# EAGLE design Adafruit FONA SIM5320 3G Breakout (EAGLE 8.2.2)
COMPANY: ADAFRUIT INDUSTRIES; DRAWN: KTOWN; REV: A
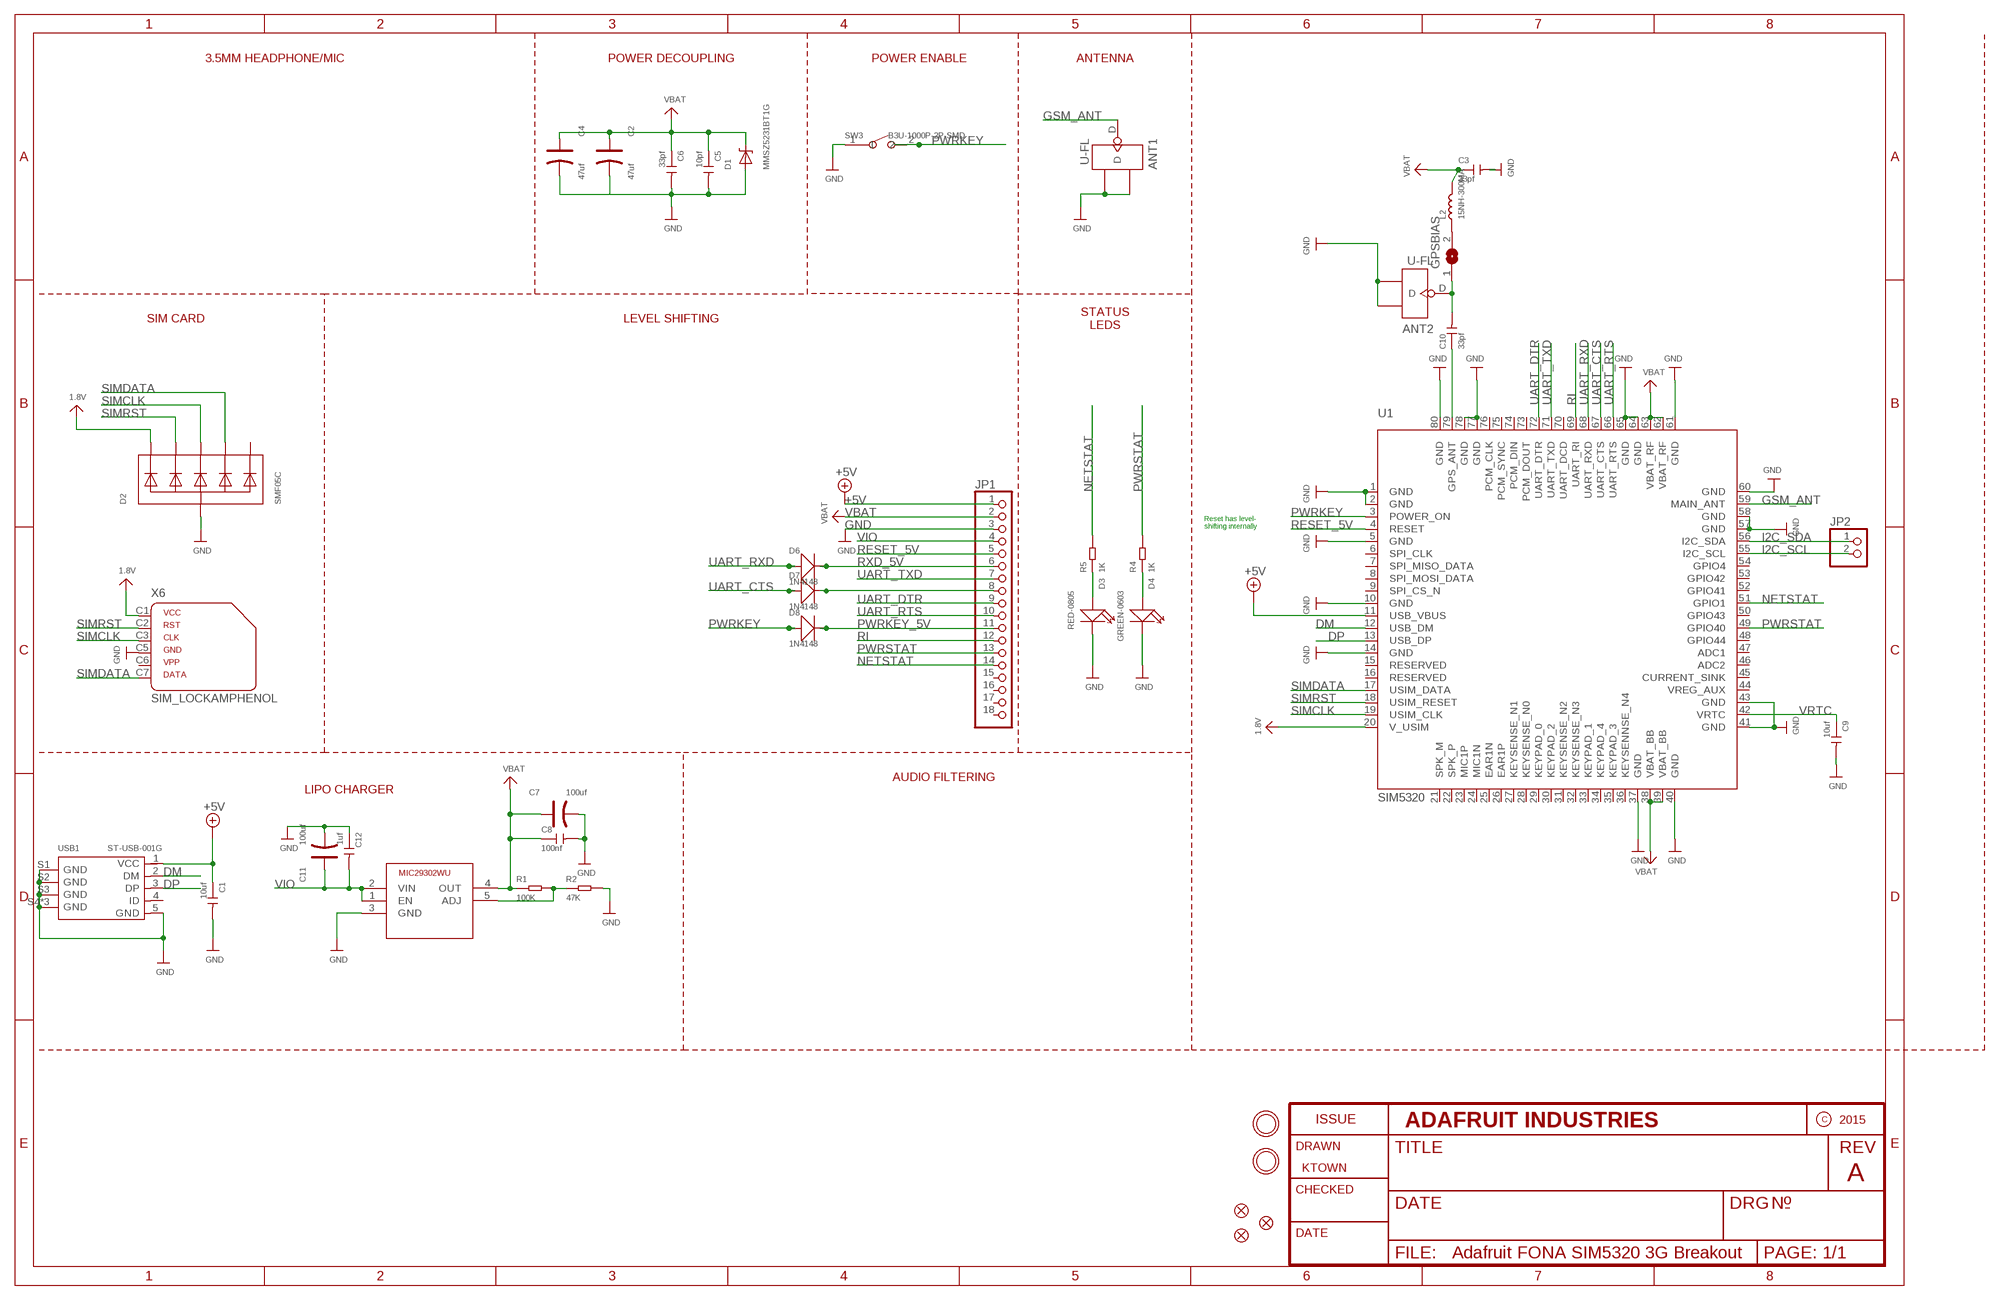
[diagram p0: schematic, sheet 1]

## Parts
ANT1  U-FL  ANTENNA-CONN-U-FL(3P)  [U-FL3P-SMD-2.6X2.6X1.0MM]
ANT2  U-FL  ANTENNA-CONN-U-FL(3P)  [U-FL3P-SMD-2.6X2.6X1.0MM]
C1  10uf  CERAMIC-10UF-10V-10%-X5R(0603)  [C0603]
C2  47uf  TANTALUM-SMD-47UF-16V-10%(AVX-B)  [AVX-B]
C3  33pf  CERAMIC-33PF-50V-5%-NPO(0402)  [C0402]
C4  47uf  TANTALUM-SMD-47UF-16V-10%(AVX-B)  [AVX-B]
C5  10pf  CERAMIC-10PF-50V-5%-NPO(0402)  [C0402]
C6  33pf  CERAMIC-33PF-50V-5%-NPO(0402)  [C0402]
C7  100uf  TANTALUM-SMD-100UF-10V(AVX-B)  [AVX-B]
C8  100nf  CERAMIC-100NF-25V-10%-X7R(0402)  [C0402]
C9  10uf  CERAMIC-10UF-25V-10%-X5R(0805)  [C0805]
C10  33pf  CERAMIC-33PF-50V-5%-NPO(0402)  [C0402]
C11  100uf  TANTALUM-SMD-100UF-10V(AVX-B)  [AVX-B]
C12  1uf  CERAMIC-1UF-25V-10%-X7R(0603)  [C0603]
D1  MMSZ5231BT1G  DIODE-ZENERSOD123  [SOD-123]
D2  SMF05C  TVSARRAY_5LANE  [SOT363]
D3  RED-0805  SMD-LED-CLEAR-RED(0805)  [LED-0805]
D4  GREEN-0603  SMD-LED-CLEAR-GREEN(0603)  [LED-0603]
D6  1N4148  SMD-DIODE-SWITCH-1N4148(LL-34)  [LL-34]
D7  1N4148  SMD-DIODE-SWITCH-1N4148(LL-34)  [LL-34]
D8  1N4148  SMD-DIODE-SWITCH-1N4148(LL-34)  [LL-34]
FID1  FIDUCIAL""  [FIDUCIAL_1MM]
FID4  FIDUCIAL""  [FIDUCIAL_1MM]
FID5  FIDUCIAL""  [FIDUCIAL_1MM]
GPSBIAS  SOLDERJUMPER  [SOLDERJUMPER_ARROW_NOPASTE]
IC1  MIC29302WU  [TO263-5]
JP1  HEADER-1X18  [1X18_ROUND70]
JP2  HEADER-1X2ROUND  [1X02_ROUND]
L2  15NH-300MA  SMD-INDUCTOR-15NH-5%-300MA(0402)  [L0402]
R1  100K  SMD-RES-100K-1%-1/10W(0603)  [R0603]
R2  47K  SMD-RES-47K-5%-1/10W(0603)  [R0603]
R4  1K  SMD-RES-1K-1%-1/10W(0603)  [R0603]
R5  1K  SMD-RES-1K-1%-1/10W(0603)  [R0603]
SW3  B3U-1000P-2P-SMD  SMD-BUTTON(2P-3.0X2.5X1.2+0.4MM)-B3U-1000P-2P-SMD  [SW2-2.6-3.0X2.5X1.2+0.4MM]
U1  SIM5320  GSM_SIM5320_LITERAL  [SIM5320]
U$33  MOUNTINGHOLE2.5  [MOUNTINGHOLE_2.5_PLATED]
U$34  MOUNTINGHOLE2.5  [MOUNTINGHOLE_2.5_PLATED]
USB1  ST-USB-001G  MICRO-USB-SMD-B-WITHOUT-POST-W/P(ST-USB-001G)  [MICRO-USB5+4P-SMD-0.65-B]
X6  SIM_LOCKAMPHENOL  [C707_10M006_512_2]

## Nets
1.8V: D2.1(C1) U1.20(V_USIM) X6.C1
+5V: C1.1 JP1.1 U1.11(USB_VBUS) USB1.1(VCC)
CTS_5V: D7.C(-) JP1.8
DM: U1.12(USB_DM) USB1.2(DM)
DP: U1.13(USB_DP) USB1.3(DP)
GND: ANT1.GND1 ANT1.GND2 ANT2.GND1 ANT2.GND2 C1.2 C2.- C3.2 C4.- C5.2 C6.2 C7.- C8.2 C9.2 C11.- C12.1 D1.A D2.2(A) D3.- D4.- IC1.3(GND) JP1.3 R2.2 SW3.1 U1.1(GND) U1.2(GND) U1.5(GND) U1.10(GND) U1.14(GND) U1.37(GND) U1.40(GND) U1.41(GND) U1.43(GND) U1.57(GND) U1.58(GND) U1.60(GND) U1.61(GND) U1.64(GND) U1.65(GND) U1.77(GND) U1.78(GND) U1.80(GND) USB1.5(GND) USB1.S1(GND) USB1.S2(GND) USB1.S3(GND) USB1.S4(GND) USB1.S5(GND) USB1.S6(GND) X6.C5
GSM_ANT: ANT1.D U1.59(MAIN_ANT)
I2C_SCL: JP2.2 U1.55(I2C_SCL)
I2C_SDA: JP2.1 U1.56(I2C_SDA)
N$2: IC1.5(ADJ) R1.2 R2.1
N$3: ANT2.D C10.2 GPSBIAS.1
N$4: D4.+ R4.1
N$7: C10.1 U1.79(GPS_ANT)
N$9: D3.+ R5.1
N$31: GPSBIAS.2 L2.1
NETSTAT: JP1.14 R5.2 U1.51(GPIO1)
PWRKEY: D8.A(+) SW3.2 U1.3(POWER_ON)
PWRKEY_5V: D8.C(-) JP1.11
PWRSTAT: JP1.13 R4.2 U1.49(GPIO40)
RESET_5V: JP1.5 U1.4(RESET)
RI: JP1.12 U1.69(UART_RI)
RXD_5V: D6.C(-) JP1.6
SIMCLK: D2.4(C3) U1.19(USIM_CLK) X6.C3
SIMDATA: D2.5(C4) U1.17(USIM_DATA) X6.C7
SIMRST: D2.3(C2) U1.18(USIM_RESET) X6.C2
UART_CTS: D7.A(+) U1.67(UART_CTS)
UART_DTR: JP1.9 U1.72(UART_DTR)
UART_RTS: JP1.10 U1.66(UART_RTS)
UART_RXD: D6.A(+) U1.68(UART_RXD)
UART_TXD: JP1.7 U1.71(UART_TXD)
VBAT: C2.+ C3.1 C4.+ C5.1 C6.1 C7.+ C8.1 D1.C IC1.4(OUT) JP1.2 L2.2 R1.1 U1.38(VBAT_BB) U1.39(VBAT_BB) U1.62(VBAT_RF) U1.63(VBAT_RF)
VIO: C11.+ C12.2 IC1.1(EN) IC1.2(VIN) JP1.4
VRTC: C9.1 U1.42(VRTC)
Unconnected: D2.6(C5) JP1.15 JP1.16 JP1.17 JP1.18 U1.6(SPI_CLK) U1.7(SPI_MISO_DATA) U1.8(SPI_MOSI_DATA) U1.9(SPI_CS_N) U1.15(RESERVED) U1.16(RESERVED) U1.21(SPK_M) U1.22(SPK_P) U1.23(MIC1P) U1.24(MIC1N) U1.25(EAR1N) U1.26(EAR1P) U1.27(KEYSENSE_N1) U1.28(KEYSENSE_N0) U1.29(KEYPAD_0) U1.30(KEYPAD_2) U1.31(KEYSENSE_N2) U1.32(KEYSENSE_N3) U1.33(KEYPAD_1) U1.34(KEYPAD_4) U1.35(KEYPAD_3) U1.36(KEYSENNSE_N4) U1.44(VREG_AUX) U1.45(CURRENT_SINK) U1.46(ADC2) U1.47(ADC1) U1.48(GPIO44) U1.50(GPIO43) U1.52(GPIO41) U1.53(GPIO42) U1.54(GPIO4) U1.70(UART_DCD) U1.73(PCM_DOUT) U1.74(PCM_DIN) U1.75(PCM_SYNC) U1.76(PCM_CLK) USB1.4(ID) X6.C6

## Notes on the sheet
- 3.5MM HEADPHONE/MIC | POWER DECOUPLING | POWER ENABLE | ANTENNA
- SIM CARD | LEVEL SHIFTING
- STATUS
  LEDS
- Reset has level-
  shifting internally
- AUDIO FILTERING
- LIPO CHARGER

## Library data of the parts
ANT1 ANT2 = Seeed-Connector:ANTENNA-CONN-U-FL(3P): 320110048
C1 = Seeed-Capacitor:CERAMIC-10UF-10V-10%-X5R(0603): 302010103; MPN: CC0603KRX5R6BB106
C2 C4 = Seeed-Capacitor:TANTALUM-SMD-47UF-16V-10%(AVX-B): 302020020; MPN: TAJB476K010RNJ
C3 C6 C10 = Seeed-Capacitor:CERAMIC-33PF-50V-5%-NPO(0402): 302010000; MPN: CC0402JRNPO9BN330
C5 = Seeed-Capacitor:CERAMIC-10PF-50V-5%-NPO(0402): 302010001; MPN: CC0402JRNPO9BN100
C7 C11 = Seeed-Capacitor:TANTALUM-SMD-100UF-10V(AVX-B): 302020015; MPN: TAJB107M010#NJ
C8 = Seeed-Capacitor:CERAMIC-100NF-25V-10%-X7R(0402): 302010024; MPN: CC0402KRX7R8BB104
C9 = Seeed-Capacitor:CERAMIC-10UF-25V-10%-X5R(0805): 302010178; MPN: CC0805KKX5R8BB106
C12 = Seeed-Capacitor:CERAMIC-1UF-25V-10%-X7R(0603): 302010139; MPN: CC0603KRX7R8BB105
D1 = microbuilder:DIODE-ZENER: Zener Diode SMA: 30V 1W Zener Diode, 1.2Vf - Digikey: SMAZ30-FDICT-ND
D2 = microbuilder:TVSARRAY_5LANE: Voltage Transient Suppressor Array SOT363 SMF05C - 100W 5V: Digikey - SMF05CT1GOSCT-ND
D3 = Seeed-LED:SMD-LED-CLEAR-RED(0805): 304090046; MPN: 17-215SURC/S530-A2/TR8
D4 = Seeed-LED:SMD-LED-CLEAR-GREEN(0603): 304090043; MPN: 19-217-G7C-AN1P2-3T
D6-D8 = Seeed-Diode:SMD-DIODE-SWITCH-1N4148(LL-34): 304040016; MPN: 1N4148
FID1 FID4 FID5 = microbuilder:FIDUCIAL: Fiducial Alignment Points Various fiducial points for machine vision alignment.; BOM: EXCLUDE
GPSBIAS = microbuilder:SOLDERJUMPER: SMD Solder JUMPER Solder the two pads together to create a connection, or remove the solder to break it. REFLOW - Use this footprint for solder paste and reflow ovens. WAVE - Use this footprint for hand-soldering (larger pads). CLOSED - Has a trace between the two pads to ensure it is closed by default. The trace needs to be cut to disable the jumper, and can be closed again by creating a solder bridge between the two pads.; BOM: EXCLUDE
IC1 = MIC29302WU:MIC29302WU; AVAILABILITY: Good; DESCRIPTION: MIC29302 Series 3 A 1.24 to 26 V ADJ Output Voltage LDO Regulator - TO-263-5; MF: Microchip; MP: MIC29302WU; PACKAGE: TO-263-5 Microchip; PRICE: 1.56 USD
JP1 = microbuilder:HEADER-1X18: Header 1x18
JP2 = microbuilder:HEADER-1X2: PIN HEADER
L2 = Seeed-Inductor:SMD-INDUCTOR-15NH-5%-300MA(0402): 303010027; MPN: LQG15HS15NJ02
R1 = Seeed-Resistor:SMD-RES-100K-1%-1/10W(0603): 301010196; MPN: RC0603FR-07100KL
R2 = Seeed-Resistor:SMD-RES-47K-5%-1/10W(0603): 301010084; MPN: RC0603JR-0747KL
R4 R5 = Seeed-Resistor:SMD-RES-1K-1%-1/10W(0603): 301010298; MPN: RC0603FR-071KL
SW3 = Seeed-Switch:SMD-BUTTON(2P-3.0X2.5X1.2+0.4MM): 311020047; MPN: B3U-1000P-2P-SMD
U1 = microbuilder:GSM_SIM5320_LITERAL
U$33 U$34 = microbuilder:MOUNTINGHOLE: Mounting Hole For #2 screws (0.086"/2.18mm width, 0.094"/2.4mm hole) use 2.5mm; BOM: EXCLUDE
USB1 = Seeed-Connector:MICRO-USB-SMD-B-WITHOUT-POST-W/P(ST-USB-001G): 320010000; MPN: ST-USB-001G
X6 = microbuilder:SIM_LOCK: C707A SIMLOCK® 2.5 mm with wide solder tails Source: Data sheet <http://www.amphenol.info/downloads/C707_10M006_512_2.pdf>; OC_FARNELL: unknown; OC_NEWARK: unknown

## Board
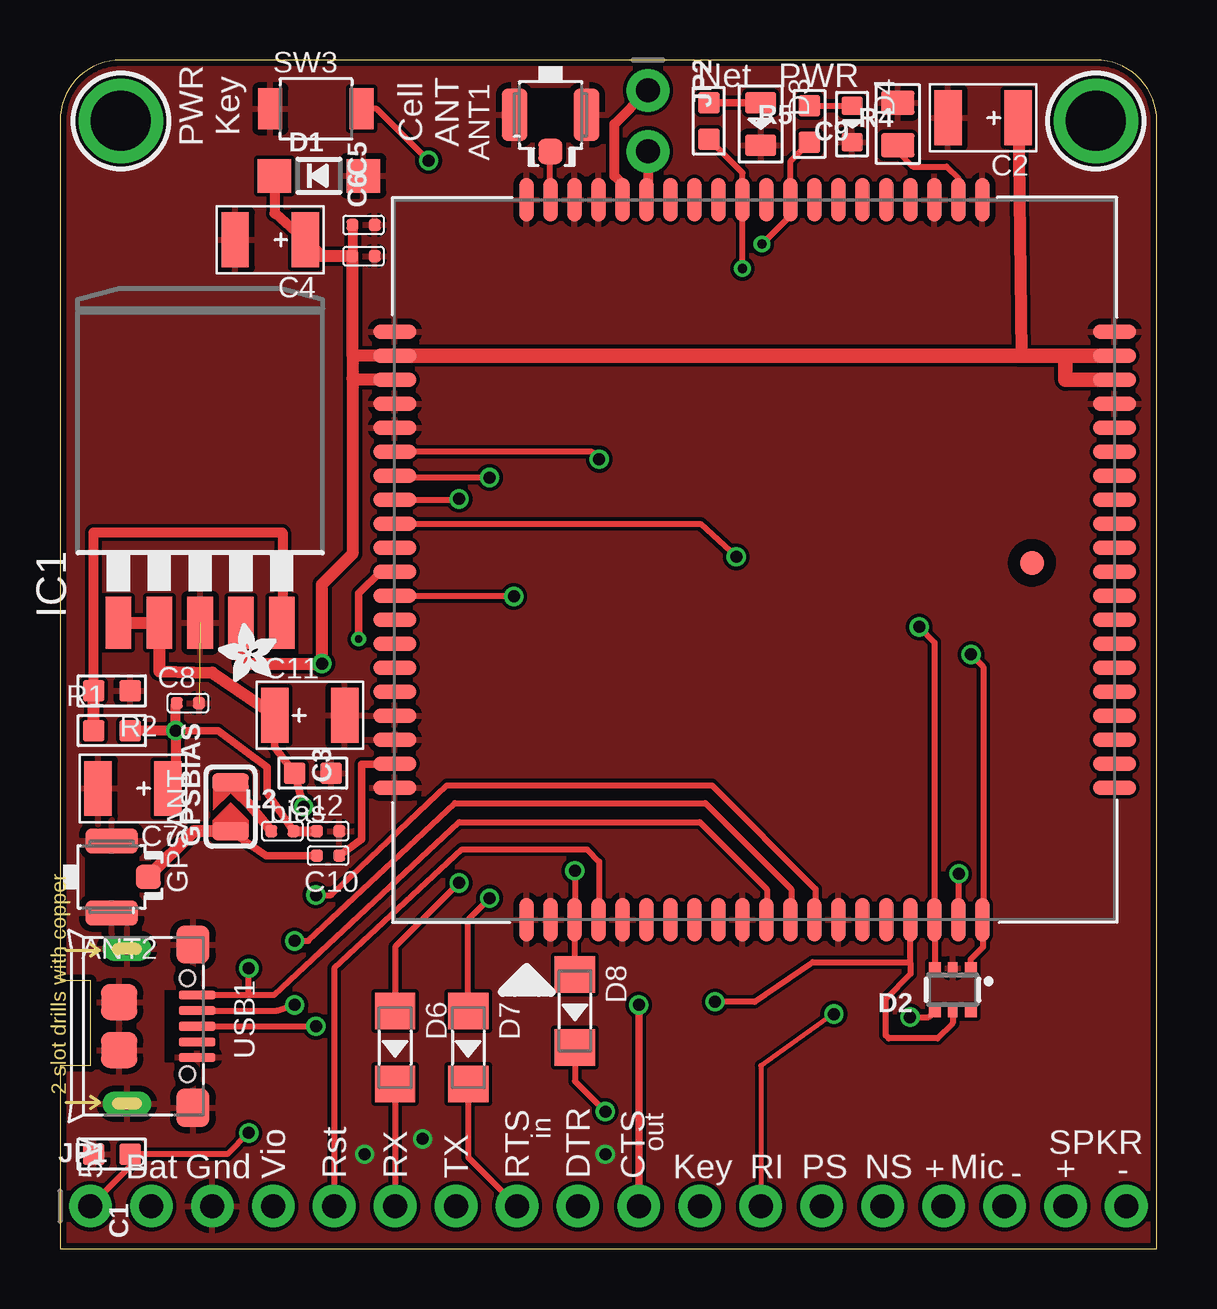
[diagram p1: board, top side]
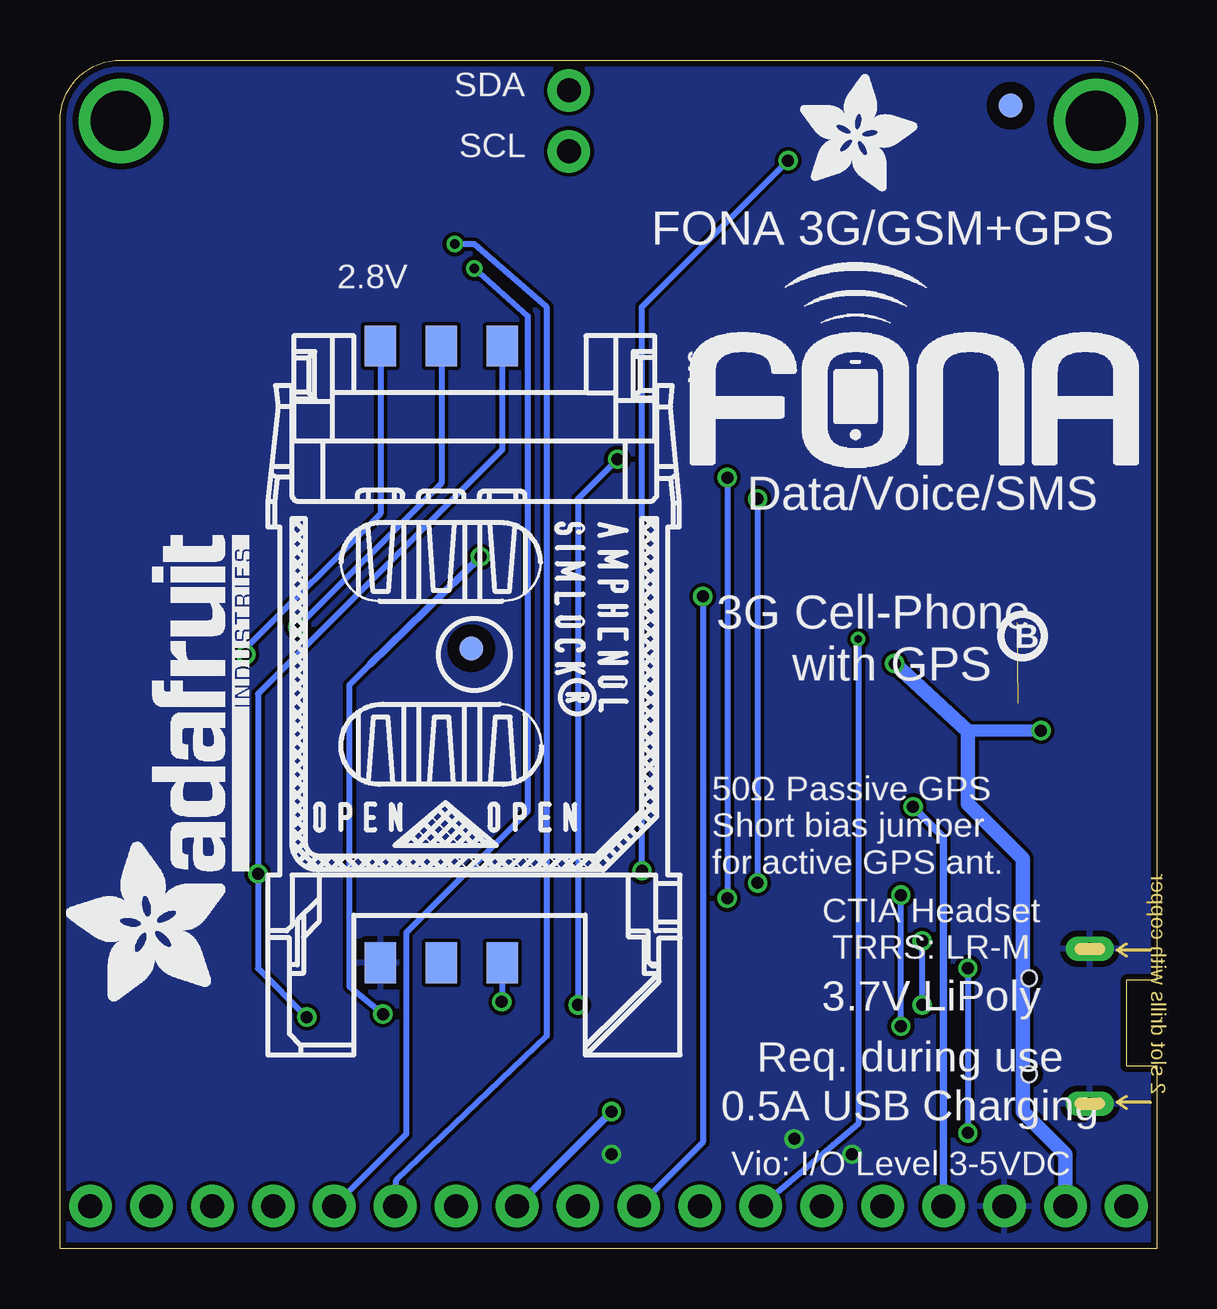
[diagram p2: board, bottom side, seen from below]

Size 45.72 x 49.53 mm. Coordinates in mm from the lower left corner, seen from the top.
Outline: 0,0 45.72,0 45.72,46.99 arc90 43.18,49.53 2.54,49.53 arc90 0,46.99 0,11.18 1.27,11.18 1.27,7.62 0,7.62 0,0
Copper layers (1*16): Top 0.035mm / dielectric 1.5mm / Bottom 0.035mm
Design rules "SeeedStudio_2layer_DRU_no_angle_20140221": minimum track width 6mil, minimum drill 12mil, track to track 6mil, track to pad 6mil, pad to pad 6mil, via to via 6mil, smd to smd 0mil, copper to edge 10mil, drill to drill 10mil, minimum pad ring 10mil, minimum via ring 6mil, stop-mask expansion 2mil, vias tented up to drill 100mil, thermal gap 10mil
tRestrict: area 13.7,34.7 to 14.2,34.8; area 13.7,21.6 to 14.2,21.7; area 19.9,13.5 to 20.1,14; area 21.8,43.4 to 22,43.9

### Footprints (pad centres in the part's own frame; a part is rotated, then mirrored left to right if it is on the bottom)
U-FL3P-SMD-2.6X2.6X1.0MM = smd 1.05 x 1: D -1.524,0 | smd 2.2 x 1.05: GND1 0,1.5; GND2 0,-1.5
C0603 = smd 0.889 x 0.889: 1 0,0.762; 2 0,-0.762
AVX-B = smd 1.143 x 2.286: + -1.46,0; - 1.46,0
C0402 = smd 0.5 x 0.5: 1 0,0.463; 2 0,-0.463
C0805 = smd 1.397 x 1.016: 1 0,0.889; 2 0,-0.889
SOD-123 = smd 1.4 x 1.4: A 1.85,0; C -1.85,0
SOT363 = smd 0.5 x 0.5: 1 -0.75,-0.9; 3 0.75,-0.9; 4 0.75,0.9; 6 -0.75,0.9 | smd 0.4 x 0.5: 2 0,-0.9; 5 0,0.9
LED-0805 = smd 0.889 x 1.27: + -0.889,0; - 0.889,0
LED-0603 = smd 0.762 x 0.889: + -0.762,0; - 0.762,0
LL-34 = smd 1.524 x 1.676: A -1.524,0; C 1.524,0
FIDUCIAL_1MM = smd 1 x 1: 1 0,0
SOLDERJUMPER_ARROW_NOPASTE = smd 0.762 x 1.524: 1 -1.016,0; 2 1.016,0
TO263-5 = smd 1.067 x 2.159: 1 -3.404,-5.791; 2 -1.702,-5.791; 3 0,-5.791; 4 1.702,-5.791; 5 3.404,-5.791
1X18_ROUND70 = drill 1 pad 1.778: 1 -21.59,0; 2 -19.05,0; 3 -16.51,0; 4 -13.97,0; 5 -11.43,0; 6 -8.89,0; 7 -6.35,0; 8 -3.81,0; 9 -1.27,0; 10 1.27,0; 11 3.81,0; 12 6.35,0; 13 8.89,0; 14 11.43,0; 15 13.97,0; 16 16.51,0; 17 19.05,0; 18 21.59,0
1X02_ROUND = drill 1 pad 1.778: 1 -1.27,0; 2 1.27,0
L0402 = smd 0.5 x 0.5: 1 -0.463,0; 2 0.463,0
R0603 = smd 0.889 x 0.889: 1 0,0.762; 2 0,-0.762
SW2-2.6-3.0X2.5X1.2+0.4MM = smd 1 x 1.7: 1 -1.9,0; 2 1.9,0
SIM5320 = smd 1.8 x 0.6: 1 -15,9.5; 2 -15,8.5; 3 -15,7.5; 4 -15,6.5; 5 -15,5.5; 6 -15,4.5; 7 -15,3.5; 8 -15,2.5; 9 -15,1.5; 10 -15,0.5; 11 -15,-0.5; 12 -15,-1.5; 13 -15,-2.5; 14 -15,-3.5; 15 -15,-4.5; 16 -15,-5.5; 17 -15,-6.5; 18 -15,-7.5; 19 -15,-8.5; 20 -15,-9.5; 41 15,-9.5; 42 15,-8.5; 43 15,-7.5; 44 15,-6.5; 45 15,-5.5; 46 15,-4.5; 47 15,-3.5; 48 15,-2.5; 49 15,-1.5; 50 15,-0.5; 51 15,0.5; 52 15,1.5; 53 15,2.5; 54 15,3.5; 55 15,4.5; 56 15,5.5; 57 15,6.5; 58 15,7.5; 59 15,8.5; 60 15,9.5 | smd 0.6 x 1.8: 21 -9.5,-15; 22 -8.5,-15; 23 -7.5,-15; 24 -6.5,-15; 25 -5.5,-15; 26 -4.5,-15; 27 -3.5,-15; 28 -2.5,-15; 29 -1.5,-15; 30 -0.5,-15; 31 0.5,-15; 32 1.5,-15; 33 2.5,-15; 34 3.5,-15; 35 4.5,-15; 36 5.5,-15; 37 6.5,-15; 38 7.5,-15; 39 8.5,-15; 40 9.5,-15; 61 9.5,15; 62 8.5,15; 63 7.5,15; 64 6.5,15; 65 5.5,15; 66 4.5,15; 67 3.5,15; 68 2.5,15; 69 1.5,15; 70 0.5,15; 71 -0.5,15; 72 -1.5,15; 73 -2.5,15; 74 -3.5,15; 75 -4.5,15; 76 -5.5,15; 77 -6.5,15; 78 -7.5,15; 79 -8.5,15; 80 -9.5,15
MOUNTINGHOLE_2.5_PLATED = drill 2.5 pad 3.2: P$1 0,0
MICRO-USB5+4P-SMD-0.65-B = smd 0.381 x 1.524: 1 -1.3,-0.25; 2 -0.65,-0.25; 3 0,-0.25; 4 0.65,-0.25; 5 1.3,-0.25 | smd 1.6 x 1.397: S1 -3.4,-0.427; S6 3.4,-0.427 | drill 0.508 pad 1.016 long: S2 -3.226,-3.175; S5 3.226,-3.175 | smd 1.5 x 1.5: S3 -1,-3.5; S4 1,-3.5 | hole 0.635: -2,-0.65; 2,-0.65
C707_10M006_512_2 = smd 1.7 x 1.3: C1 -12.85,-3.915; C2 -12.85,-1.375; C3 -12.85,1.165; C5 12.85,-3.915; C6 12.85,-1.375; C7 12.85,1.165

### Placement (x,y rotation side)
ANT1  20.45,47.24 90 top
ANT2  2.16,15.49 180 top
C1  2.16,3.94 270 top
C2  38.48,47.12 180 top
C3  11.18,17.4 90 top
C4  8.76,42.04 180 top
C5  12.65,42.66 90 top
C6  12.65,41.35 90 top
C7  3.05,19.18 180 top
C8  5.33,22.73 90 top
C9  34.92,46.86 180 top
C10  11.18,16.38 270 top
C11  10.41,22.23 0 top
C12  10.54,19.81 270 top
D1  10.79,44.7 0 top
D2  37.21,10.79 180 top
D3  29.21,46.86 270 top
D4  33.02,46.86 270 top
D6  13.97,8.38 270 top
D7  17.02,8.38 270 top
D8  21.46,9.91 270 top
FID1  40.51,28.57 0 top
FID4  6.1,47.62 0 bottom
FID5  28.57,25.02 0 bottom
GPSBIAS  7.11,18.41 90 top
IC1  5.84,31.88 0 top
JP1  22.86,1.78 0 top
JP2  24.51,46.99 270 top
L2  9.27,17.4 0 top
R1  2.16,21.59 270 top
R2  2.16,23.24 90 top
R4  31.24,46.86 0 top
R5  27.05,46.99 0 top
SW3  10.67,47.5 0 top
U1  28.96,28.7 90 top
U$21  [ADAFRUIT_2.5MM]  9.02,23.62 90 top
U$25  [PCBFEAT-REV-040]  5.59,25.53 0 bottom
U$26  [FONA_LOGO]  19.94,32.38 0 bottom
U$33  43.18,46.99 90 top
U$34  2.54,46.99 90 top
U$36  [ADAFRUIT_5MM]  14.86,44.07 0 bottom
U$42  [ADAFRUIT_TEXT_20MM]  37.85,10.16 90 bottom
USB1  5.97,9.27 270 top
X6  28.45,24.77 270 bottom

### Tracks (layer width: path | path; a pad name or v marks a point on that pad's centre or on a via)
1.8V  (via drill 0.5)
  Top 0.254: D2.1 37.96,12.05 38.48,12.57 38.48,13.68 | 38.48,13.68 U1.20 | v37.97,24.77 38.48,24.26 38.48,13.68
  Bottom 0.254: X6.C1 32.36,30.63 37.97,25.02 v37.97,24.77
+5V  (via drill 0.5)
  Top 0.254: 7.87,10.57 8.92,10.57 16.64,17.78 26.67,17.78 29.46,14.99 U1.11 | 7.87,10.57 USB1.1 | 7.87,10.57 v7.87,11.68 | v7.87,4.83 6.99,3.94 C1.1 2.92,3.43 JP1.1
  Bottom 0.254: v7.87,11.68 v7.87,4.83
CTS_5V
  Top 0.254: JP1.8 17.02,3.81 D7.C
DM  (via drill 0.5)
  Top 0.254: USB1.2 9.03,9.92 v9.78,10.16 | U1.12 30.48,13.8 30.48,14.99 26.9,18.57 16.47,18.57 10.35,12.83 v9.78,12.83
  Bottom 0.254: v9.78,10.16 v9.78,12.83
DP  (via drill 0.5)
  Top 0.254: USB1.3 v10.67,9.27 | v10.67,14.73 11.3,14.73 16.13,19.3 27.18,19.3 31.5,14.99 31.5,13.74 U1.13
  Bottom 0.254: v10.67,9.27 v10.67,14.73
GND  (via drill 0.5)  (1 unrouted)
  other vias: 22.73,3.94 15.11,4.57 12.7,3.94
  pour Top: 0,50.8 0,0 45.72,0 45.72,50.8
  pour Bottom: 0,50.8 0,0 45.72,0 45.72,50.8
GSM_ANT
  Top 0.152: 20.42,45.72 ANT1.D | 20.42,43.89 U1.59
  Top 0.254: 20.42,43.89 20.42,45.72
  Top 0.61: U1.59 20.45,43.71
I2C_SCL
  Top 0.406: JP2.2 24.51,43.76 U1.55
I2C_SDA
  Top 0.406: U1.56 23.5,43.74 23.5,44.32 23.11,44.7 23.11,46.86 JP2.1
N$2
  Top 0.406: R2.1 1.4,29.84 9.27,29.84 9.27,26.11 IC1.5
  Top 0.508: R1.2 R2.1
N$3
  Top 0.305: GPSBIAS.1 8.59,16.38 C10.2
  Top 0.508: GPSBIAS.1 5.59,17.4 ANT2.D
N$4
  Top 0.254: R4.1 D4.+
N$7
  Top 0.305: U1.79 13.95,20.19 12.57,20.19 12.57,17.06 C10.1
N$9
  Top 0.305: R5.1 D3.+
N$31
  Top 0.406: GPSBIAS.2 L2.1
NETSTAT  (via drill 0.39)
  Top 0.203: 28.45,43.69 U1.51 28.45,43.89 28.45,44.3
  Top 0.254: v28.45,40.84 28.45,43.69 | U1.51 28.46,44.82 R5.2
  Bottom 0.152: 31.29,4.8 31.29,4.78
  Bottom 0.254: v28.45,40.84 26.21,38.86 26.21,18.24 31.29,13.16 31.29,4.8 | 31.29,4.78 JP1.14
PWRKEY  (via drill 0.5)
  Top 0.152: U1.3
  Top 0.254: v15.37,45.34 13.97,46.74 13.2,47.5 SW3.2 | D8.A U1.3 v21.46,15.75
  Bottom 0.254: v15.37,45.34 21.46,39.24 v21.46,15.75
PWRKEY_5V  (via drill 0.5)
  Top 0.254: D8.C 21.46,6.99 v22.73,5.71
  Bottom 0.305: v22.73,5.71 JP1.11
PWRSTAT  (via drill 0.39)
  Top 0.203: 30.28,42.88 30.28,43.69 U1.49
  Top 0.254: v29.26,41.86 30.28,42.88 | U1.49 30.46,45.31 R4.2
  Bottom 0.203: 31.7,1.83 JP1.13
  Bottom 0.254: v29.26,41.86 28.45,41.86 25.43,39.22 25.43,8.87 31.7,2.85 31.7,1.83
RESET_5V
  Top 0.254: JP1.5 11.43,11.68 16.76,16.64 21.97,16.64 22.48,16.13 22.48,13.72 U1.4
RI  (via drill 0.5)
  Top 0.152: v32.25,9.79 v32.26,9.78
  Top 0.203: v32.25,9.79 29.21,7.63 JP1.12
  Top 0.254: U1.69 26.69,30.2 v28.19,28.83
  Bottom 0.254: v32.26,9.78 33.66,10.92 33.66,23.5 32.77,24.38
  Bottom 0.305: v28.19,28.83 32.77,24.38
RXD_5V
  Top 0.254: D6.C JP1.6
SIMCLK  (via drill 0.5)
  Top 0.254: U1.19 v37.47,15.62 | v35.43,9.65 36.22,9.65 D2.4
  Bottom 0.254: v35.43,9.65 37.47,11.68 v37.47,15.62 37.47,23.11 27.28,33.3 X6.C3
SIMDATA  (via drill 0.5)
  Top 0.254: D2.5 37.21,9.4 36.58,8.76 34.54,8.76 34.42,8.89 34.42,10.41 35.46,11.45 35.46,11.88 | 35.46,11.88 U1.17 | v27.3,10.29 28.96,10.29 31.37,11.94 35.4,11.94 35.46,11.88
  Bottom 0.254: X6.C7 27.28,10.31 v27.3,10.29
SIMRST  (via drill 0.5)
  Top 0.254: D2.3 U1.18 36.46,25.27 v35.81,25.91
  Bottom 0.254: X6.C2 29.82,31.9 v35.81,25.91
UART_CTS  (via drill 0.5)
  Top 0.254: v17.91,32.13 14.03,32.13 U1.67 | v17.91,14.61 17.02,13.72 D7.A
  Bottom 0.254: v17.91,32.13 v17.91,14.61
UART_DTR  (via drill 0.5)
  Top 0.254: v18.92,27.18 13.98,27.18 U1.72
  Bottom 0.254: JP1.9 18.92,4.45 v18.92,27.18
UART_RTS  (via drill 0.5)
  Top 0.254: v22.48,32.89 22.17,33.2 U1.66
  Top 0.305: JP1.10 v24.13,10.16
  Bottom 0.254: v22.48,32.89 24.13,31.24 v24.13,10.16
UART_RXD  (via drill 0.5)
  Top 0.254: v16.64,15.24 13.97,12.57 D6.A | U1.68 16.47,31.2 v16.64,31.24
  Bottom 0.254: v16.64,31.24 v16.64,15.24
UART_TXD  (via drill 0.3)
  Top 0.152: 13.87,28.19 U1.71 13.95,28.19
  Top 0.305: v12.45,25.4 12.45,27.3 13.34,28.19 13.87,28.19
  Bottom 0.254: JP1.7 12.45,5.21 v12.45,25.4
VBAT  (via drill 0.5)
  Top 0.305: L2.2 8.64,19 8.64,20.07 6.6,21.59 v4.83,21.59
  Top 0.406: L2.2 C3.1 | D1.C 8.95,43.13 9.01,43.13 C4.+ | C5.1 C6.1 | v4.83,21.59 R1.1 | v4.83,21.59 4.83,22.69 C8.1 | v4.83,21.59 4.83,19.49 C7.+
  Top 0.508: 13.27,36.2 U1.63 | C2.+ 40.07,37.26 40.01,37.2 | U1.63 13.46,36.2 | R1.1 2.97,21.67 | 4.57,20.07 4.57,19.24 C7.+ | 12.19,37.24 C6.1 10.9,41.35 C4.+ | 12.19,37.24 12.19,36.25 | U1.62 12.23,37.2 12.19,37.24 | U1.63 12.24,36.2 12.19,36.25 | 12.19,36.25 12.19,28.95 10.92,27.69 v10.92,24.38 7.62,24.38 7.54,24.46 IC1.4
  Top 0.61: 41.91,37.2 40.01,37.2 U1.62 | 41.91,37.2 U1.39 | U1.38 41.91,36.2 41.91,37.2
  Bottom 0.305: 7.91,19.05 7.87,19.09
  Bottom 0.508: v4.83,21.59 7.85,21.59 7.87,21.57
  Bottom 0.61: JP1.2 3.81,3.94 5.59,5.71 5.59,16.26 7.87,18.54 7.87,19.09 7.87,21.57 v10.92,24.38
VIO  (via drill 0.5)
  Top 0.305: v10.16,18.41 C12.2 8.95,20.89 C11.+
  Top 0.508: IC1.1 IC1.2 4.14,24.05 6.35,24 C11.+
  Bottom 0.305: v10.16,18.41 8.89,17.14 JP1.4
VRTC
  Top 0.254: U1.42 37.47,44.58 36.96,45.09 35.56,45.09 34.92,45.72 C9.1

### Text on the board
tPlace: PWR / Key | Net | PWR | Cell / ANT | bias | GPSANT | in | out | SPKR | 5V | Bat | Gnd | Vio | Rst | RX | TX | RTS | DTR | CTS | Key | RI | PS | NS | + | Mic | - | + | -
bPlace: SDA | SCL | FONA 3G/GSM+GPS | 2.8V | Data/Voice/SMS | 3G Cell-Phone | with GPS | 50Ω Passive GPS / Short bias jumper / for active GPS ant. | CTIA Headset / TRRS: LR-M | 3.7V LiPoly | Req. during use | 0.5A USB Charging | Vio: I/O Level 3-5VDC